# Altium schematic sheet PLL.SchDoc
size A4
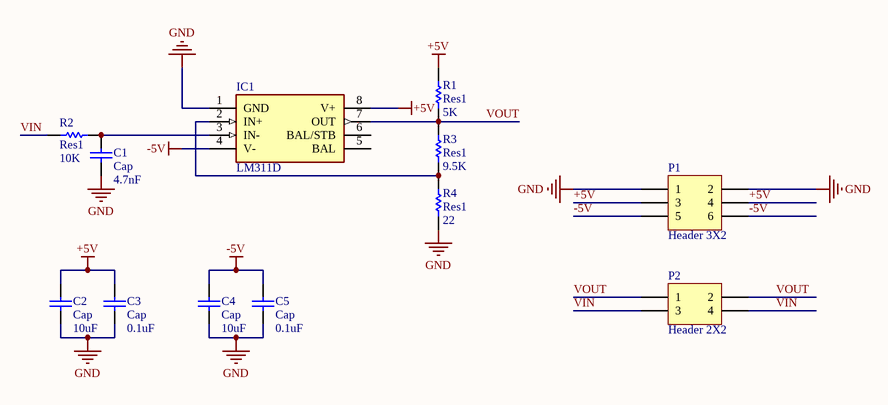
[diagram p0: PLL.SchDoc]

## Parts
C1  Cap  value 4.7nF  [1608[0603]]
C2  Cap  value 10uF  [1608[0603]]
C3  Cap  value 0.1uF  [1608[0603]]
C4  Cap  value 10uF  [1608[0603]]
C5  Cap  value 0.1uF  [1608[0603]]
IC1  LM311D  [SOIC127P600X175-8N]
P1  Header 3X2  [HDR2X3]
P2  Header 2X2  [HDR2X2]
R1  Res1  value 5K  [J1-0603]
R2  Res1  value 10K  [J1-0603]
R3  Res1  value 9.5K  [J1-0603]
R4  Res1  value 22  [J1-0603]

## Nets
+5V: C2.2 C3.2 IC1.8(V+) P1.3 P1.4 R1.2
-5V: C4.2 C5.2 IC1.4(V-) P1.5 P1.6
GND: C1.1 C2.1 C3.1 C4.1 C5.1 IC1.1(GND) P1.1 P1.2 R4.1
VIN: P2.3 P2.4 R2.2
VOUT: IC1.7(OUT) P2.1 P2.2 R1.1 R3.2
NetC1_2: C1.2 IC1.3(IN-) R2.1
NetIC1_2: IC1.2(IN+) R3.1 R4.2

Not connected (* = marked no-connect by the designer): IC1 5(BAL) 6(BAL/STB)

## Library data of the parts
C1-C5 = Cap: Capacitor; Published: 8-Jun-2000; LatestRevisionDate: 17-Jul-2002; LatestRevisionNote: Re-released for DXP Platform.; PackageReference: RAD-0.3; Publisher: Altium Limited; PackageDescription: Radial Cap, Thru-Hole; 2 Leads; 0.3 in Pin Spacing
IC1 = LM311D: Integrated Circuit; Manufacturer_Name: STMicroelectronics; Allied_Number: 70013578; Datasheet Link: http://www.st.com/st-web-ui/static/active/en/resource/technical/document/datasheet/CD00001072.pdf; Height: 1.75mm; Manufacturer_Part_Number: LM311D; Mouser Part Number: 511-LM311D; Mouser Price/Stock: https://www.mouser.com/Search/Refine.aspx?Keyword=511-LM311D; RS Part Number: 1686808; RS Price/Stock: http://uk.rs-online.com/web/p/products/1686808; Allied Price/Stock: http://www.alliedelec.com/stmicroelectronics-lm311d/70013578/
P1 = Header 3X2: Header, 3-Pin, Dual row; LatestRevisionDate: 17-Jul-2002; LatestRevisionNote: Re-released for DXP Platform.; Publisher: Altium Limited
P2 = Header 2X2: Header, 2-Pin, Dual row; LatestRevisionDate: 17-Jul-2002; LatestRevisionNote: Re-released for DXP Platform.; Publisher: Altium Limited
R1-R4 = Res1: Resistor; Published: 8-Jun-2000; LatestRevisionDate: 17-Jul-2002; LatestRevisionNote: Re-released for DXP Platform.; PackageReference: AXIAL-0.3; Publisher: Altium Limited; PackageDescription: Axial Device, Thru-Hole; 2 Leads; 0.3 in Pin Spacing